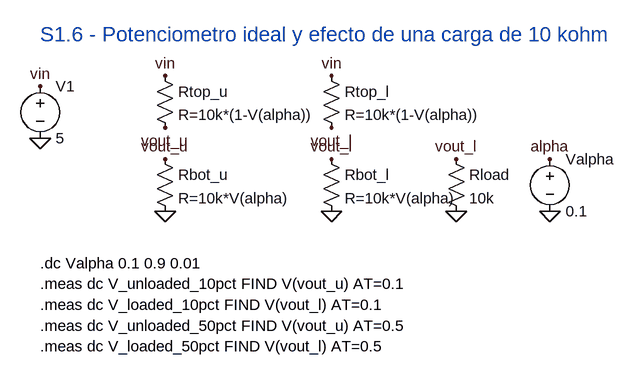
[diagram p0: schematic semana1_06_divisor_cargado.asc]
semana1_06_divisor_cargado.asc, the LTspice schematic file:
Version 4
SHEET 1 1040 720
SYMBOL voltage 48 112 R0
SYMATTR InstName V1
SYMATTR Value 5
SYMBOL res 224 96 R0
SYMATTR InstName Rtop_u
SYMATTR Value R=10k*(1-V(alpha))
SYMBOL res 224 224 R0
SYMATTR InstName Rbot_u
SYMATTR Value R=10k*V(alpha)
SYMBOL res 480 96 R0
SYMATTR InstName Rtop_l
SYMATTR Value R=10k*(1-V(alpha))
SYMBOL res 480 224 R0
SYMATTR InstName Rbot_l
SYMATTR Value R=10k*V(alpha)
SYMBOL res 672 224 R0
SYMATTR InstName Rload
SYMATTR Value 10k
SYMBOL voltage 832 224 R0
SYMATTR InstName Valpha
SYMATTR Value 0.1
FLAG 48 128 vin
FLAG 48 208 0
FLAG 240 112 vin
FLAG 240 192 vout_u
FLAG 240 240 vout_u
FLAG 240 320 0
FLAG 496 112 vin
FLAG 496 192 vout_l
FLAG 496 240 vout_l
FLAG 496 320 0
FLAG 688 240 vout_l
FLAG 688 320 0
FLAG 832 240 alpha
FLAG 832 320 0
TEXT 48 400 Left 2 !.dc Valpha 0.1 0.9 0.01
TEXT 48 432 Left 2 !.meas dc V_unloaded_10pct FIND V(vout_u) AT=0.1
TEXT 48 464 Left 2 !.meas dc V_loaded_10pct FIND V(vout_l) AT=0.1
TEXT 48 496 Left 2 !.meas dc V_unloaded_50pct FIND V(vout_u) AT=0.5
TEXT 48 528 Left 2 !.meas dc V_loaded_50pct FIND V(vout_l) AT=0.5
TEXT 48 48 Left 3 ;S1.6 - Potenciometro ideal y efecto de una carga de 10 kohm

The netlist it stands for:
* semana1_06_divisor_cargado.asc
V1 vin 0 5
Rtop_u vin vout_u R=10k*(1-V(alpha))
Rbot_u vout_u 0 R=10k*V(alpha)
Rtop_l vin vout_l R=10k*(1-V(alpha))
Rbot_l vout_l 0 R=10k*V(alpha)
Rload vout_l 0 10k
Valpha alpha 0 0.1
.dc Valpha 0.1 0.9 0.01
.meas dc V_unloaded_10pct FIND V(vout_u) AT=0.1
.meas dc V_loaded_10pct FIND V(vout_l) AT=0.1
.meas dc V_unloaded_50pct FIND V(vout_u) AT=0.5
.meas dc V_loaded_50pct FIND V(vout_l) AT=0.5
* S1.6 - Potenciometro ideal y efecto de una carga de 10 kohm
.backanno
.end